# EAGLE design amplifier1 (EAGLE 9.6.2)
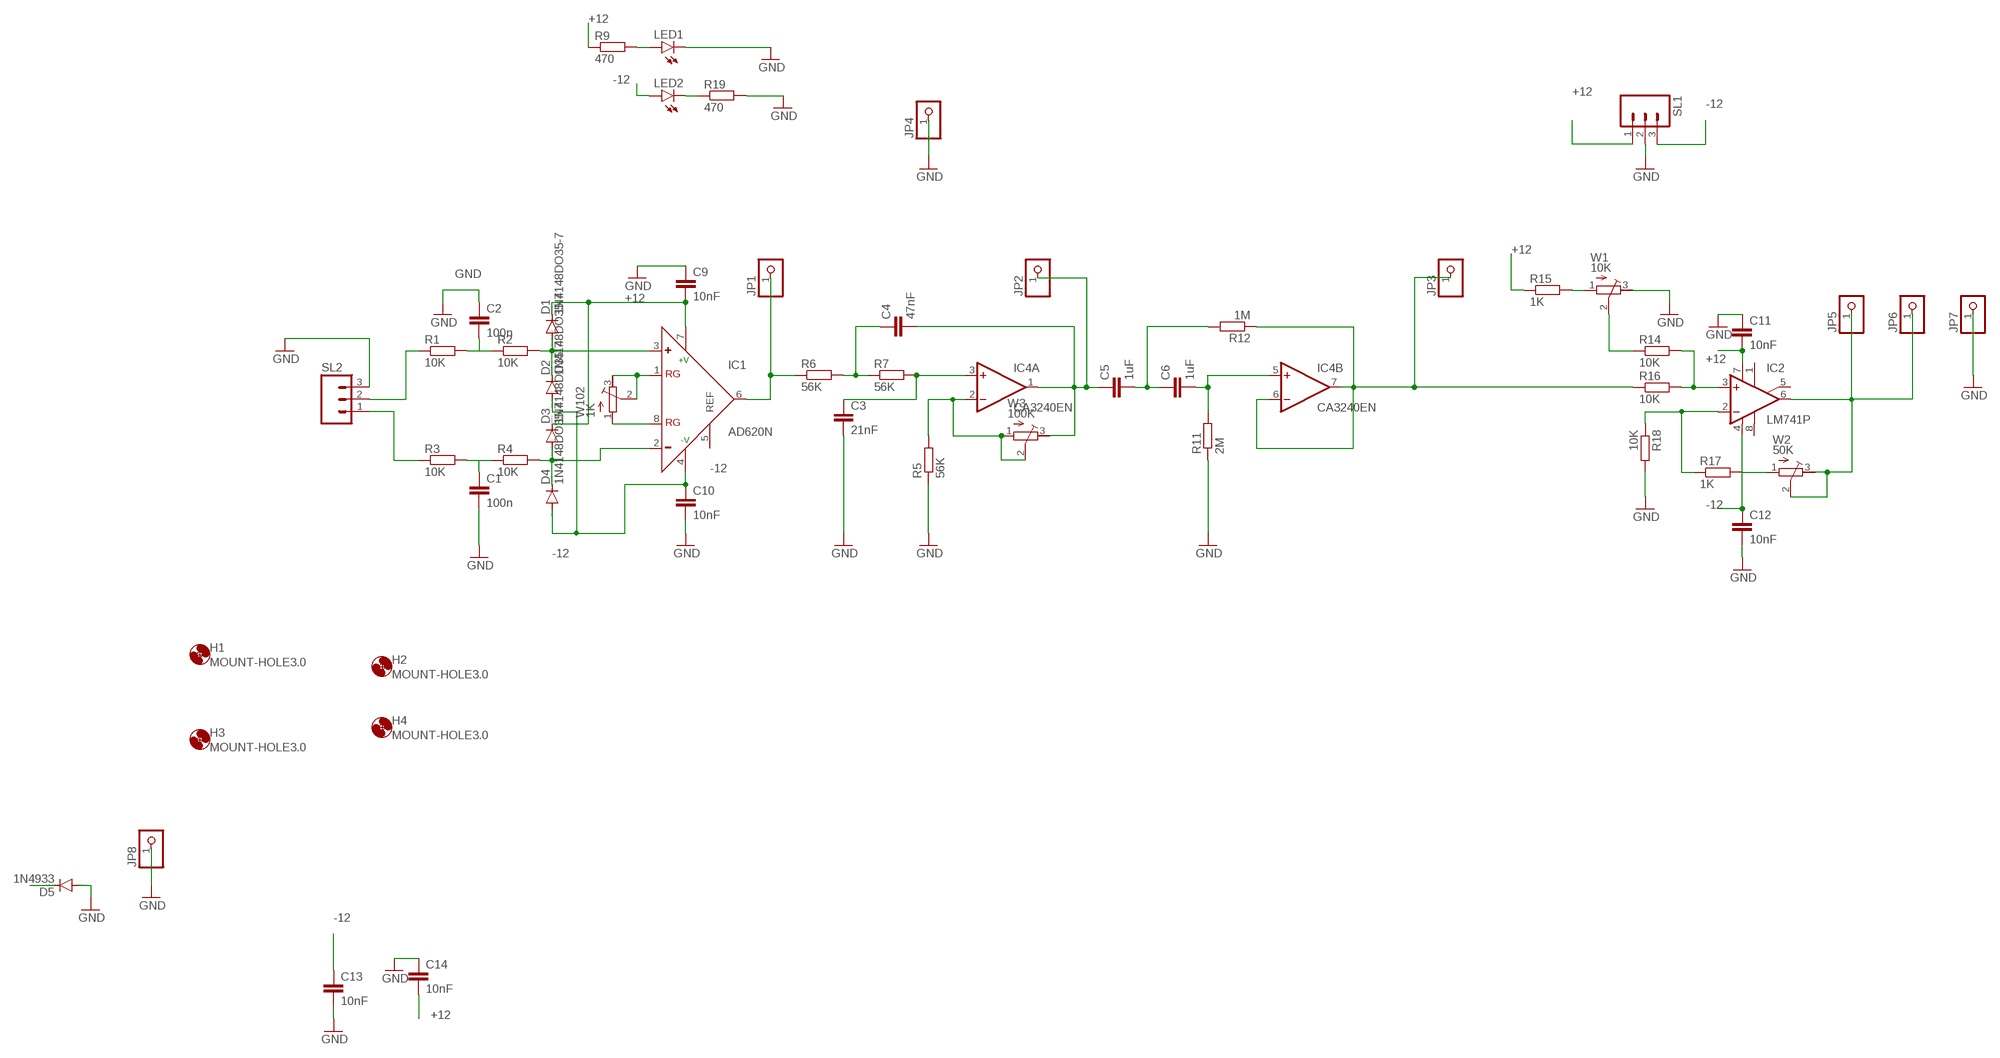
[diagram p0: schematic, sheet 1]

## Parts
C1  100n  C-EU025-025X050  [C025-025X050]
C2  100n  C-EU025-025X050  [C025-025X050]
C3  21nF  C-EU025-025X050  [C025-025X050]
C4  47nF  C-EU025-025X050  [C025-025X050]
C5  1uF  C-EU025-025X050  [C025-025X050]
C6  1uF  C-EU025-025X050  [C025-025X050]
C9  10nF  C-EU025-040X050  [C025-040X050]
C10  10nF  C-EU025-040X050  [C025-040X050]
C11  10nF  C-EU025-040X050  [C025-040X050]
C12  10nF  C-EU025-040X050  [C025-040X050]
C13  10nF  C-EU025-040X050  [C025-040X050]
C14  10nF  C-EU025-040X050  [C025-040X050]
D1  1N4148DO35-7  [DO35-7]
D2  1N4148DO35-7  [DO35-7]
D3  1N4148DO35-7  [DO35-7]
D4  1N4148DO35-7  [DO35-7]
D5  1N4933  [DO41-10]
H1  MOUNT-HOLE3.0  [3,0]
H2  MOUNT-HOLE3.0  [3,0]
H3  MOUNT-HOLE3.0  [3,0]
H4  MOUNT-HOLE3.0  [3,0]
IC1  AD620N  [DIL08]
IC2  LM741P  [DIL08]
IC4  CA3240EN  [DIL08]
JP1  PINHD-1X1  [1X01]
JP2  PINHD-1X1  [1X01]
JP3  PINHD-1X1  [1X01]
JP4  PINHD-1X1  [1X01]
JP5  PINHD-1X1  [1X01]
JP6  PINHD-1X1  [1X01]
JP7  PINHD-1X1  [1X01]
JP8  PINHD-1X1  [1X01]
LED1  LED5MM  [LED5MM]
LED2  LED5MM  [LED5MM]
R1  10K  R-EU_0207/10  [0207/10]
R2  10K  R-EU_0207/10  [0207/10]
R3  10K  R-EU_0207/10  [0207/10]
R4  10K  R-EU_0207/10  [0207/10]
R5  56K  R-EU_0204/7  [0204/7]
R6  56K  R-EU_0207/10  [0207/10]
R7  56K  R-EU_0207/10  [0207/10]
R9  470  R-EU_0204/7  [0204/7]
R11  2M  R-EU_0207/10  [0207/10]
R12  1M  R-EU_0207/10  [0207/10]
R14  10K  R-EU_0204/7  [0204/7]
R15  1K  R-EU_0204/7  [0204/7]
R16  10K  R-EU_0204/7  [0204/7]
R17  1K  R-EU_0204/7  [0204/7]
R18  10K  R-EU_0204/7  [0204/7]
R19  470  R-EU_0204/7  [0204/7]
SL1  M03  [03P]
SL2  M03  [03P]
W1  10K  R-TRIMM3299W  [RTRIM3299W]
W2  50K  R-TRIMM3299W  [RTRIM3299W]
W3  100K  R-TRIMM3299W  [RTRIM3299W]
W102  1K  R-TRIMM3299W  [RTRIM3299W]

## Nets
+12: C9.2 C11.2 C14.2 D1.C D3.C IC1.7(+V) IC2.7(V+) R9.1 R15.1 SL1.1
-12: C10.1 C12.1 C13.1 D2.A D4.A IC1.4(-V) IC2.4(V-) LED2.A SL1.3
GND: C1.2 C2.1 C3.2 C9.1 C10.2 C11.1 C12.2 C13.2 C14.1 D5.A JP4.1 JP7.1 JP8.1 LED1.K(C) R5.1 R11.1 R18.2 R19.2 SL1.2 SL2.3 W1.3(E)
N$1: R1.1 SL2.2
N$2: R3.1 SL2.1
N$3: C1.1 R3.2 R4.1
N$4: C2.2 R1.2 R2.1
N$5: D1.A D2.C IC1.3(+) R2.2
N$6: D3.A D4.C IC1.2(-) R4.2
N$7: IC4.2(A:-IN) R5.2 W3.1(A) W3.2(S)
N$8: IC4.6(B:-IN) IC4.7(B:OUT) JP3.1 R12.1 R16.1
N$9: IC1.8(RG) W102.1(A)
N$10: IC1.1(RG) W102.2(S) W102.3(E)
N$11: D5.C
N$12: IC1.6(OUT) JP1.1 R6.1
N$13: LED1.A R9.2
N$14: C5.2 C6.1 R12.2
N$15: C4.1 R6.2 R7.1
N$16: C4.2 C5.1 IC4.1(A:OUT) JP2.1 W3.3(E)
N$17: C3.1 IC4.3(A:+IN) R7.2
N$18: C6.2 IC4.5(B:+IN) R11.2
N$22: LED2.K(C) R19.1
N$24: R15.2 W1.1(A)
N$25: R14.1 W1.2(S)
N$26: IC2.3(+IN) R14.2 R16.2
N$27: IC2.2(-IN) R17.1 R18.1
N$28: IC2.6(OUT) JP5.1 JP6.1 W2.2(S) W2.3(E)
N$30: R17.2 W2.1(A)
Unconnected: IC1.5(REF) IC2.1(ON1) IC2.5(ON2) IC2.8(OPT)

## Power pins joined to a net without a drawn wire
+12: IC4.8(P:V+)
-12: IC4.4(P:V-)

## Library data of the parts
C1-C6 = rcl:C-EU: CAPACITOR, European symbol
C9-C14 = rcl:C-EU: CAPACITOR, European symbol; SPICEPREFIX: C
D1-D4 = diode:1N4148: DIODE high speed (Philips)
D5 = diode:1N4933: DIODE fast recovery rectifier, 1A
H1-H4 = holes:MOUNT-HOLE: MOUNTING HOLE with drill center marker
IC1 = analog-devices:AD620: Low Cost, Low Power, Instrumentation Amplifier Source: http://www.analog.com/UploadedFiles/Data_Sheets/37793330023930AD620_e.pdf; MF: ALTERA CORPORATION; MPN: AD620AN; OC_FARNELL: 1523782; OC_NEWARK: 05F7108
IC2 = linear:*741: OP AMP
IC4 = linear:CA3240E: OP AMP
JP1-JP8 = pinhead:PINHD-1X1: PIN HEADER
LED1 LED2 = led:LED: LED OSRAM: - CHIPLED LG R971, LG N971, LY N971, LG Q971, LY Q971, LO R971, LY R971 LH N974, LH R974 LS Q976, LO Q976, LY Q976 LO Q996 - Hyper CHIPLED LW Q18S LB Q993, LB Q99A, LB R99A - SideLED LS A670, LO A670, LY A670, LG A670, LP A670 LB A673, LV A673, LT A673, LW A673 LH A674 LY A675 LS A676, LA A676, LO A676, LY A676, LW A676 LS A679, LY A679, LG A679 - Hyper Micro SIDELED® LS Y876, LA Y876, LO Y876, LY Y876 LT Y87S - SmartLED LW L88C, LW L88S LB L89C, LB L89S, LG L890 LS L89K, LO L89K, LY L89K LS L896, LA L896, LO L896, LY L896 - TOPLED LS T670, LO T670, LY T670, LG T670, LP T670 LSG T670, LSP T670, LSY T670, LOP T670, LYG T670 LG T671, LOG T671, LSG T671 LB T673, LV T673, LT T673, LW T673 LH T674 LS T676, LA T676, LO T676, LY T676, LB T676, LH T676, LSB T676, LW T676 LB T67C, LV T67C, LT T67C, LS T67K, LO T67K, LY T67K, LW E67C LS E67B, LA E67B, LO E67B, LY E67B, LB E67C, LV E67C, LT E67C LW T67C LS T679, LY T679, LG T679 LS T770, LO T770, LY T770, LG T770, LP T770 LB T773, LV T773, LT T773, LW T773 LH T774 LS E675, LA E675, LY E675, LS T675 LS T776, LA T776, LO T776, LY T776, LB T776 LHGB T686 LT T68C, LB T68C - Hyper Mini TOPLED® LB M676 - Mini TOPLED Santana® LG M470 LS M47K, LO M47K, LY M47K Source: http://www.osram.convergy.de LUXEON: - LUMILED® LXK2-PW12-R00, LXK2-PW12-S00, LXK2-PW14-U00, LXK2-PW14-V00 LXK2-PM12-R00, LXK2-PM12-S00, LXK2-PM14-U00 LXK2-PE12-Q00, LXK2-PE12-R00, LXK2-PE12-S00, LXK2-PE14-T00, LXK2-PE14-U00 LXK2-PB12-K00, LXK2-PB12-L00, LXK2-PB12-M00, LXK2-PB14-N00, LXK2-PB14-P00, LXK2-PB14-Q00 LXK2-PR12-L00, LXK2-PR12-M00, LXK2-PR14-Q00, LXK2-PR14-R00 LXK2-PD12-Q00, LXK2-PD12-R00, LXK2-PD12-S00 LXK2-PH12-R00, LXK2-PH12-S00 LXK2-PL12-P00, LXK2-PL12-Q00, LXK2-PL12-R00 Source: www.luxeon.com KINGBRIGHT: KA-3528ASYC Source: www.kingbright.com
R1-R4 R6 R7 R11 R12 = rcl:R-EU_: RESISTOR, European symbol
R5 R9 R14-R19 = rcl:R-EU_: RESISTOR, European symbol; SPICEPREFIX: R
SL1 SL2 = con-amp-quick:M03: AMP QUICK CONNECTOR; OC_FARNELL: unknown; OC_NEWARK: unknown
W1-W3 W102 = rcl:R-TRIMM: Trimm resistor

## Board
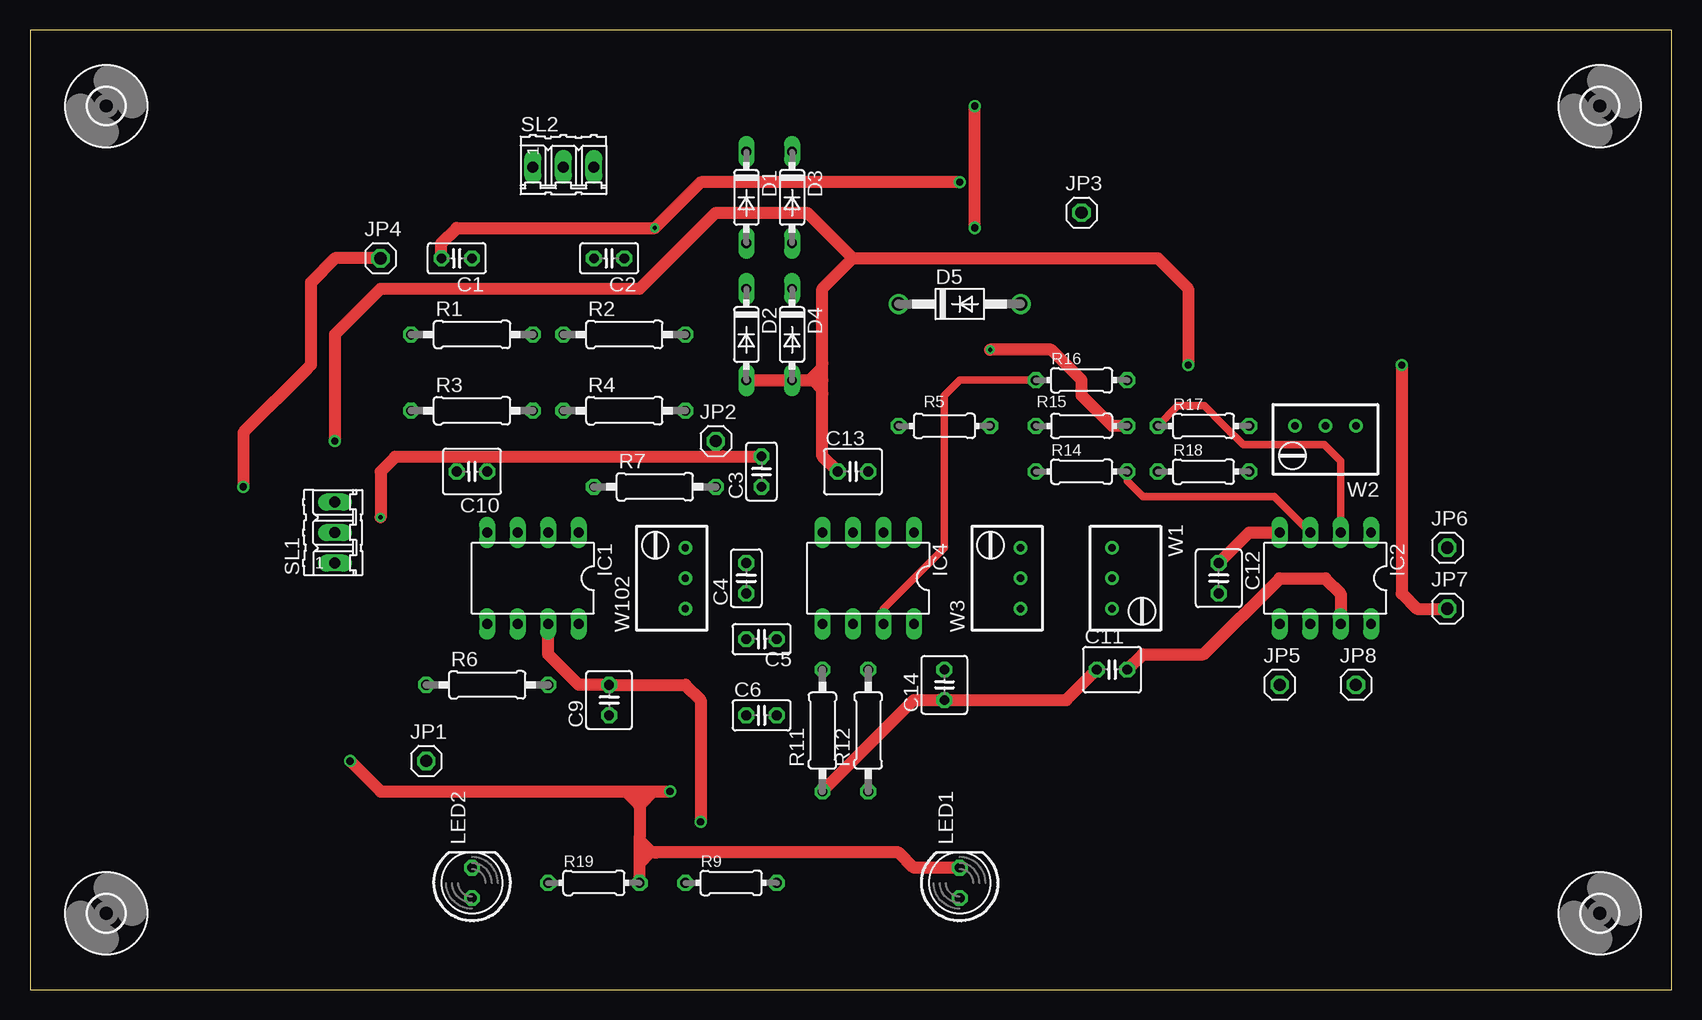
[diagram p1: board, top side]
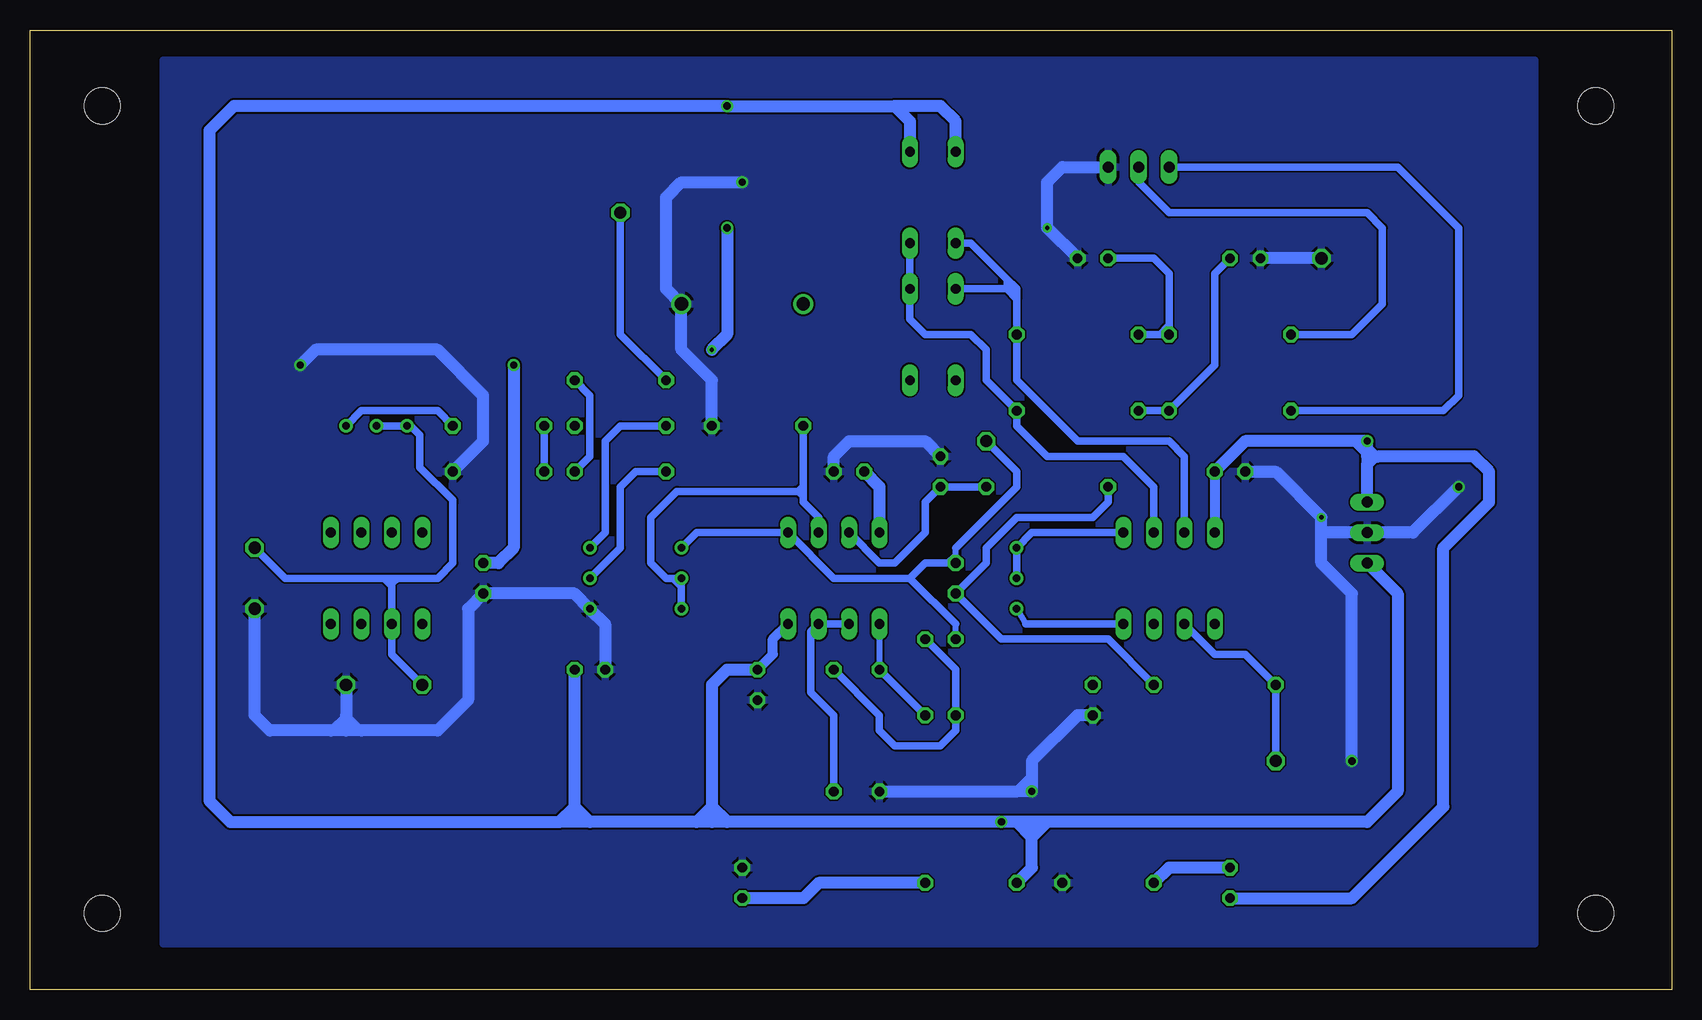
[diagram p2: board, bottom side, seen from below]

Size 136.83 x 80 mm. Coordinates in mm from the lower left corner, seen from the top.
Outline: 0,0 136.83,0 136.83,80 0,80 0,0
Copper layers (1*16): Top 0.035mm / dielectric 1.5mm / Bottom 0.035mm
Design rules "default": minimum track width 6mil, minimum drill 0.35mm, track to track 6mil, track to pad 6mil, pad to pad 6mil, via to via 6mil, smd to smd 6mil, copper to edge 40mil, drill to drill 6mil, minimum pad ring 10mil, minimum via ring 8mil, stop-mask expansion 4mil, vias tented up to drill 0mil, thermal gap 10mil

### Footprints (pad centres in the part's own frame; a part is rotated, then mirrored left to right if it is on the bottom)
C025-025X050 = drill 0.813 octagon: 1 -1.27,0; 2 1.27,0
C025-040X050 = drill 0.813 octagon: 1 -1.27,0; 2 1.27,0
DO35-7 = drill 0.813 long: A 3.81,0; C -3.81,0
DO41-10 = drill 1.118: A 5.08,0; C -5.08,0
3,0 = hole 3: 0,0
DIL08 = drill 0.813 long: 1 -3.81,-3.81; 2 -1.27,-3.81; 3 1.27,-3.81; 4 3.81,-3.81; 5 3.81,3.81; 6 1.27,3.81; 7 -1.27,3.81; 8 -3.81,3.81
DIL08' = drill 0.813 pad 1.27 long: 1 -3.81,-3.81; 2 -1.27,-3.81; 3 1.27,-3.81; 4 3.81,-3.81; 5 3.81,3.81; 6 1.27,3.81; 7 -1.27,3.81; 8 -3.81,3.81
1X01 = drill 1.016 octagon: 1 0,0
LED5MM = drill 0.813 octagon: A -1.27,0; K 1.27,0
0207/10 = drill 0.813 octagon: 1 -5.08,0; 2 5.08,0
0204/7 = drill 0.813 octagon: 1 -3.81,0; 2 3.81,0
03P = drill 0.914 long: 1 -2.54,0; 2 0,0; 3 2.54,0
RTRIM3299W = drill 0.61: 1 1.27,-2.54; 2 1.27,0; 3 1.27,2.54

### Placement (x,y rotation side)
C1  35.56,60.96 180 top
C2  48.26,60.96 180 top
C3  60.96,43.18 90 top
C4  59.69,34.29 90 top
C5  60.96,29.21 0 top
C6  60.96,22.86 0 top
C9  48.26,24.13 90 top
C10  36.83,43.18 180 top
C11  90.17,26.67 0 top
C12  99.06,34.29 270 top
C13  68.58,43.18 0 top
C14  76.2,25.4 90 top
D1  59.69,66.04 270 top
D2  59.69,54.61 270 top
D3  63.5,66.04 270 top
D4  63.5,54.61 270 top
D5  77.47,57.15 0 top
H1  130.81,73.66 0 top
H2  130.81,6.35 0 top
H3  6.35,6.35 0 top
H4  6.35,73.66 0 top
IC1  41.91,34.29 180 top
IC2  LM741P  [DIL08']  107.95,34.29 180 top
IC4  CA3240EN  [DIL08']  69.85,34.29 180 top
JP1  33.02,19.05 0 top
JP2  57.15,45.72 0 top
JP3  87.63,64.77 0 top
JP4  29.21,60.96 0 top
JP5  104.14,25.4 0 top
JP6  118.11,36.83 0 top
JP7  118.11,31.75 0 top
JP8  110.49,25.4 0 top
LED1  77.47,8.89 90 top
LED2  36.83,8.89 90 top
R1  36.83,54.61 0 top
R2  49.53,54.61 0 top
R3  36.83,48.26 0 top
R4  49.53,48.26 0 top
R5  76.2,46.99 180 top
R6  38.1,25.4 0 top
R7  52.07,41.91 0 top
R9  58.42,8.89 0 top
R11  66.04,21.59 90 top
R12  69.85,21.59 90 top
R14  87.63,43.18 0 top
R15  87.63,46.99 180 top
R16  87.63,50.8 0 top
R17  97.79,46.99 0 top
R18  97.79,43.18 0 top
R19  46.99,8.89 0 top
SL1  25.4,38.1 90 top
SL2  44.45,68.58 0 top
W1  91.44,34.29 180 top
W2  107.95,45.72 90 top
W3  81.28,34.29 0 top
W102  53.34,34.29 0 top

### Tracks (layer width: path | path; a pad name or v marks a point on that pad's centre or on a via)
+12  (via drill 0.35, 0.6 pad 1)
  Top 1.016: IC1.7 43.18,27.94 45.72,25.4 C9.2 54.61,25.4 55.88,24.13 v55.88,13.97 | v78.74,63.5 v78.74,73.66 | R15.1 90.17,46.99 87.63,49.53 87.63,50.8 85.09,53.34 v80.01,53.34 | C11.2 92.71,27.94 97.79,27.94 104.14,34.29 107.95,34.29 109.22,33.02 IC2.7
  Bottom 0.813: IC4.8 74.93,29.21 74.93,27.94 C14.2
  Bottom 1.016: SL1.1 22.86,33.02 22.86,16.51 25.4,13.97 52.07,13.97 | 52.07,13.97 53.34,13.97 | 53.34,13.97 54.61,13.97 | 54.61,13.97 v55.88,13.97 78.74,13.97 | 78.74,13.97 80.01,13.97 | 80.01,13.97 81.28,13.97 | R9.1 53.34,10.16 53.34,12.7 | 53.34,12.7 53.34,13.97 | C14.2 78.74,26.67 80.01,25.4 80.01,15.24 | 80.01,15.24 80.01,13.97 | 78.74,13.97 80.01,15.24 | 81.28,13.97 80.01,15.24 | 52.07,13.97 53.34,12.7 | 54.61,13.97 53.34,12.7 | 81.28,13.97 90.17,13.97 | 90.17,13.97 91.44,15.24 | 90.17,13.97 92.71,13.97 | 64.77,73.66 v78.74,73.66 119.85,73.66 121.89,71.62 121.89,15.73 120.13,13.97 92.71,13.97 | 92.71,13.97 91.44,15.24 | 91.44,15.24 C11.2 | 64.77,73.66 63.5,72.39 D3.C | D1.C 59.69,72.39 60.96,73.66 64.77,73.66 | v78.74,63.5 78.74,54.61 v80.01,53.34
-12  (via drill 0.6 pad 1)
  Top 0.508: 66.04,52.2 64.9,51.05 64.9,50.8 66.04,49.66
  Top 1.016: v25.4,45.72 25.4,54.61 29.21,58.42 50.8,58.42 57.15,64.77 64.77,64.77 68.58,60.96 | C13.1 66.04,44.45 66.04,49.66 66.04,50.8 | 66.04,50.8 66.04,52.2 66.04,58.42 68.58,60.96 | C12.1 101.6,38.1 IC2.4 | v96.52,52.07 96.52,58.42 93.98,60.96 68.58,60.96 | 66.04,50.8 64.9,50.8 D4.A D2.A
  Bottom 0.508: 25.4,43.81 25.06,43.81 24.42,44.45 25.13,45.16 25.4,45.16 | 26.31,45.72 26.31,45.36 25.4,44.45
  Bottom 0.813: C10.1 IC1.4
  Bottom 1.016: C13.1 66.04,41.91 IC4.4 | SL1.3 25.4,43.81 25.4,44.45 | LED2.A 26.67,7.62 19.05,15.24 19.05,36.83 15.24,40.64 15.24,43.18 16.51,44.45 24.42,44.45 25.4,44.45 | 25.4,44.45 25.4,45.16 v25.4,45.72 26.31,45.72 35.56,45.72 C10.1 | C12.1 97.79,35.56 96.52,36.83 v96.52,52.07
GND  (via drill 0.35, 0.6 pad 1)
  Top 0.61: 50.8,12.7 52.07,11.43 51.94,11.43 50.8,10.29
  Top 0.813: 22.15,50.8 23.14,51.79 23.42,52.07 | 57.75,44.45 57.7,44.4 | 49.53,16.51 50.8,15.24 52.07,16.51
  Top 1.016: 57.75,44.45 C3.2 | 23.42,52.07 23.42,58.98 25.4,60.96 JP4.1 | v26.67,19.05 29.21,16.51 49.53,16.51 50.8,16.51 | v17.78,41.91 17.78,46.43 23.14,51.79 | 50.8,16.51 52.07,16.51 v53.34,16.51 | v29.21,39.37 29.21,43.18 30.43,44.4 57.7,44.4 | R19.2 50.8,10.29 50.8,11.43 | 50.8,11.43 50.8,12.7 50.8,15.24 50.8,16.51 | LED1.K 73.66,10.16 72.39,11.43 52.2,11.43 52.07,11.43 50.8,11.43 | C1.2 34.29,62.23 35.56,63.5 v52.07,63.5 55.88,67.31 v77.47,67.31 | R11.1 73.66,24.13 C14.1 86.36,24.13 C11.1 | v114.3,52.07 114.3,33.02 115.57,31.75 JP7.1
  Bottom 0.61: 109.22,21.59 110.49,22.86 111.76,21.59
  Bottom 0.813: 54.61,16.51 53.34,17.78
  Bottom 1.016: JP4.1 C1.2 | v26.67,19.05 26.67,33.02 29.21,35.56 29.21,38.1 | v17.78,41.91 21.59,38.1 SL1.2 29.21,38.1 | R11.1 54.61,16.51 v53.34,16.51 53.34,17.78 53.34,19.05 49.53,22.86 C9.1 | 29.21,38.1 v29.21,39.37 33.02,43.18 C10.2 | C2.1 v52.07,63.5 52.07,67.31 50.8,68.58 SL2.3 | C3.2 62.23,45.72 68.58,45.72 69.85,44.45 C13.2 | v77.47,67.31 82.55,67.31 83.82,66.04 83.82,58.42 D5.A 82.55,53.34 80.01,50.8 R5.1 | C11.1 88.9,30.48 W1.3 91.44,33.02 C12.2 100.33,31.75 100.33,24.13 102.87,21.59 109.22,21.59 110.49,21.59 | JP7.1 118.11,22.86 116.84,21.59 111.76,21.59 110.49,21.59 | R18.2 99.06,45.72 99.06,49.53 102.87,53.34 113.03,53.34 v114.3,52.07 | JP8.1 110.49,22.86 110.49,21.59
  pour Bottom: 11.43,77.47 11.43,3.81 125.73,3.81 125.73,77.47
N$1
  Bottom 0.61: R1.1 26.67,54.61 24.13,57.15 24.13,63.5 25.4,64.77 41.91,64.77 44.45,67.31 SL2.2
N$2
  Bottom 0.61: R3.1 19.05,48.26 17.78,49.53 17.78,63.5 22.86,68.58 SL2.1
N$3
  Bottom 0.61: R4.1 R3.2 38.1,52.07 38.1,59.69 C1.1
N$4
  Bottom 0.508: 42.78,54.61 41.97,55.42 41.91,55.42
  Bottom 0.61: R2.1 42.78,54.61 R1.2 41.91,55.42 41.91,59.69 43.18,60.96 C2.2
N$5
  Bottom 0.508: 55.57,59.38 55.47,59.28 55.47,58.42
  Bottom 0.61: IC1.3 40.64,44.45 41.91,45.72 49.53,45.72 54.61,50.8 R2.2 54.61,57.58 | 54.61,58.42 54.61,57.58 | 54.61,58.42 55.57,59.38 58.42,62.23 D1.A | D2.C 55.47,58.42 55.45,58.42 | 55.45,58.42 54.61,58.42 | 54.61,57.58 55.45,58.42
N$6
  Bottom 0.61: IC1.2 43.18,41.91 45.72,44.45 52.07,44.45 54.61,46.99 R4.2 57.15,50.8 57.15,53.34 58.42,54.61 62.23,54.61 63.5,55.88 D4.C D3.A
N$7
  Bottom 0.2: 72.39,42.29 73.02,41.66 73.02,41.53
  Bottom 0.305: 72.39,41.02 72.52,41.02 73.02,41.53
  Bottom 0.406: 72.39,42.55 72.39,42.42
  Bottom 0.508: 82.55,33.53 83.31,34.29
  Bottom 0.61: IC4.2 71.12,39.37 72.39,40.64 72.39,41.02 72.39,41.53 | W3.1 82.55,33.53 W3.2 83.31,34.29 83.82,34.29 85.09,35.56 85.09,39.37 82.93,41.53 73.02,41.53 72.39,41.53 | 72.39,41.53 72.39,42.29 72.39,42.55 R5.2
N$8
  Top 0.61: IC4.7 71.12,31.75 76.2,36.83 76.2,49.53 77.47,50.8 R16.1
  Bottom 0.61: R12.1 69.85,22.86 71.75,24.77 71.75,29.84 IC4.7 IC4.6 | R16.1 87.63,54.61 JP3.1
N$9
  Bottom 0.508: W102.1 53.85,30.48
  Bottom 0.61: IC1.8 53.85,30.48
N$10
  Bottom 0.61: W102.2 W102.3 53.34,38.1 IC1.1
N$12
  Bottom 0.61: IC1.6 38.1,27.94 35.56,27.94 R6.1 JP1.1
N$13
  Bottom 1.016: R9.2 71.12,8.89 72.39,7.62 LED1.A
N$14
  Bottom 0.61: C5.2 59.69,26.67 C6.1 59.69,21.59 60.96,20.32 64.77,20.32 66.04,21.59 66.04,22.86 R12.2
N$15
  Bottom 0.61: R6.2 46.99,29.21 55.88,29.21 C4.1 57.15,35.56 57.15,36.83 54.61,39.37 48.26,39.37 46.99,40.64 R7.1
N$16
  Bottom 0.508: C5.1 59.69,30.48 | C4.2 59.69,36.25 | 59.69,36.25 59.69,36.83 | 60.6,35.56 60.38,35.56 59.69,36.25
  Bottom 0.61: 59.69,30.48 63.5,34.29 | C4.2 60.6,35.56 62.23,35.56 63.5,34.29 | JP2.1 54.61,43.18 54.61,41.91 59.69,36.83 | 63.5,34.29 69.85,34.29 IC4.1 81.28,38.1 W3.3
N$17
  Bottom 0.61: R7.2 C3.1 62.23,40.64 62.23,38.1 64.77,35.56 66.04,35.56 IC4.3
N$18
  Bottom 0.508: IC4.5 R11.2
  Bottom 0.61: C6.2 R11.2
N$22
  Bottom 1.016: LED2.K 41.91,10.16 R19.1
N$24
  Bottom 0.61: W1.1 88.9,38.1 88.9,45.72 87.63,46.99 R15.2
N$25
  Bottom 0.61: R14.1 86.36,43.18 87.63,41.91 87.63,36.83 W1.2
N$26
  Top 0.61: IC2.3 103.67,41.11 92.73,41.11 91.44,42.4 R14.2
  Bottom 0.61: R16.2 90.17,49.53 90.17,44.45 R14.2
N$27
  Top 0.61: IC2.2 109.22,44.06 107.85,45.43 101.1,45.43 99.49,47.04 97.86,48.67 95.66,48.67 R17.1
  Bottom 0.61: R17.1 R18.1
N$28
  Bottom 0.61: W2.2 W2.3 105.09,46.99 104.34,46.24 104.34,43.54 101.6,40.8 101.6,40.64 101.6,40.57 101.6,35.56 102.87,34.29 106.23,34.29 | JP5.1 106.68,27.94 IC2.6 106.68,33.82 | 106.68,34.29 106.23,34.29 | 106.68,34.29 107.31,34.29 | 107.31,34.29 115.57,34.29 JP6.1 | 106.68,33.84 106.68,34.29 | 107.31,34.29 106.84,33.82 106.68,33.82 | 106.23,34.29 106.68,33.84 | 106.68,33.84 106.68,33.82
N$30
  Bottom 0.61: R17.2 102.87,48.26 109.22,48.26 W2.1